# Altium project US29080671(A).PrjPCB (part 9 of 10)
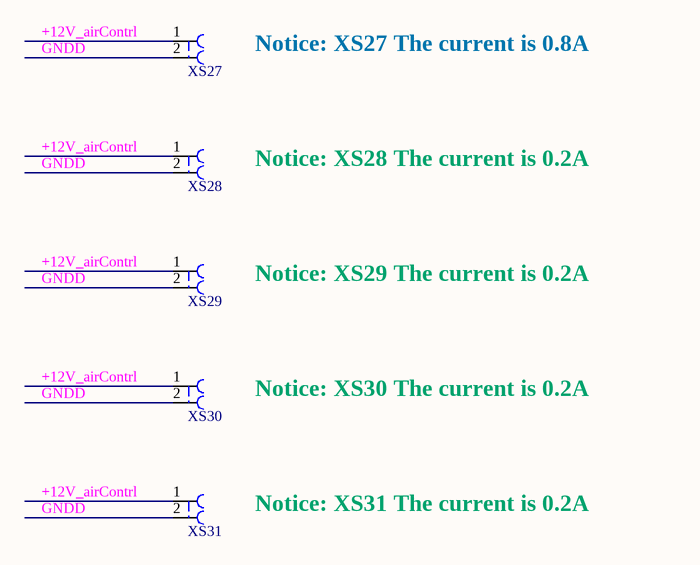
[diagram p43: MY_beamControl_R_风扇供电接口.SchDoc]
## Nets that join several sheets
GNDD: A7_JTAG&CONFIG (5 pins), A7_MGT (52 pins), A7_POWER (112 pins), A7_GND (256 pins), A7_FUNCTION2 (V18.2 V19.2), A7_FUNCTION2 - Ⅱ (V24.2 V25.2), A7_JTAG&CONFIG - Ⅱ (5 pins), A7_MGT - Ⅱ (52 pins), A7_POWER - Ⅱ (112 pins), A7_GND - Ⅱ (256 pins), POWER_B1 (17 pins), POWER_B2 (30 pins), POWER_B3 (11 pins), MY_beamControl_R_组件电源分配 (36 pins), Z7_BLOCK (7 pins), Z7_POWER1 (70 pins), Z7_POWER2 (201 pins), Z7_JTAG&DEBUG (15 pins), Z7_USB (16 pins), Z7_BANK_DDR3 (6 pins), Z7_DDR3 (85 pins), Z7_BANK500_501 (9 pins), Z7_ETHERNET (38 pins), Z7_STORAGE (32 pins), Z7_MGTX (32 pins), Z7_FUNCTION1 (8 pins), Z7_FUNCTION2 (6 pins), Z7_FUNCTION3 (8 pins), ZYNQ_reset (D26.3), MY_beamControl_R_对内接口 (108 pins), MY_beamControl_R_对外接口 (27 pins), MY_beamControl_R电平转换 (54 pins), MY_beamControl_R_风扇供电接口 (5 pins)
VCC1V0: A7_MGT (25 pins), A7_POWER (95 pins), A7_MGT - Ⅱ (25 pins), A7_POWER - Ⅱ (95 pins), POWER_B1 (22 pins), Z7_POWER1 (71 pins)
VCC1V2: A7_MGT (33 pins), A7_MGT - Ⅱ (33 pins), POWER_B2 (5 pins), Z7_POWER1 (31 pins), Z7_MGTX (D1.AB10 R241.1)
VCC1V8: A7_JTAG&CONFIG (L3.1), A7_POWER (38 pins), A7_JTAG&CONFIG - Ⅱ (L1.1), A7_POWER - Ⅱ (38 pins), POWER_B2 (5 pins), POWER_B3 (R105.2), Z7_POWER1 (46 pins), Z7_POWER2 (34 pins), Z7_JTAG&DEBUG (6 pins), Z7_USB (9 pins), Z7_BANK500_501 (10 pins), Z7_ETHERNET (D23.3 R287.2 R288.2 R289.2), Z7_STORAGE (18 pins), Z7_FUNCTION1 (5 pins), ZYNQ_reset (D26.5), MY_beamControl_R电平转换 (18 pins)
VCC1V35: POWER_B2 (5 pins), Z7_POWER1 (14 pins), Z7_BANK_DDR3 (R166.1 R171.2), Z7_DDR3 (66 pins)
VCC3V3: A7_JTAG&CONFIG (7 pins), A7_POWER (139 pins), A7_JTAG&CONFIG - Ⅱ (7 pins), A7_POWER - Ⅱ (139 pins), POWER_B3 (6 pins), Z7_BLOCK (JTAG1.2), Z7_POWER1 (C414.1 D1.P15), Z7_POWER2 (60 pins), Z7_JTAG&DEBUG (9 pins), Z7_USB (C468.1 D20.20 D20.21 R283.2), Z7_ETHERNET (12 pins), Z7_STORAGE (14 pins), Z7_FUNCTION2 (6 pins), Z7_FUNCTION3 (C342.2 D13.1), MY_beamControl_R_对外接口 (C504.1 C506.1 D24.4 L31.1)
+5V_1: MY_beamControl_R_组件电源分配 (L17.2 R120.2 XJ1.1), MY_beamControl_R_对内接口 (8 pins)
+5V_2: MY_beamControl_R_组件电源分配 (L21.2 R123.2 XJ4.1), MY_beamControl_R_对内接口 (8 pins)
+5V_3: MY_beamControl_R_组件电源分配 (L24.2 R126.2 XJ7.1), MY_beamControl_R_对内接口 (8 pins)
+5V_4: MY_beamControl_R_组件电源分配 (L26.2 R298.2 XJ9.1), MY_beamControl_R_对内接口 (8 pins)
+5V_5: MY_beamControl_R_组件电源分配 (L28.2 R300.2 XJ11.1), MY_beamControl_R_对内接口 (8 pins)
+5V_6: MY_beamControl_R_组件电源分配 (L18.2 R121.2 XJ2.1), MY_beamControl_R_对内接口 (8 pins)
+5V_7: MY_beamControl_R_组件电源分配 (L22.2 R124.2 XJ5.1), MY_beamControl_R_对内接口 (8 pins)
+5V_8: MY_beamControl_R_组件电源分配 (L25.2 R127.2 XJ8.1), MY_beamControl_R_对内接口 (8 pins)
+5V_9: MY_beamControl_R_组件电源分配 (L27.2 R299.2 XJ10.1), MY_beamControl_R_对内接口 (8 pins)
+5V_10: MY_beamControl_R_组件电源分配 (L29.2 R301.2 XJ12.1), MY_beamControl_R_对内接口 (8 pins)
+5V_11: MY_beamControl_R_组件电源分配 (L20.2 R122.2 XJ3.1), MY_beamControl_R_对内接口 (8 pins)
+5V_12: MY_beamControl_R_组件电源分配 (L23.2 R125.2 XJ6.1), MY_beamControl_R_对内接口 (8 pins)
-5V: MY_beamControl_R_对内接口 (96 pins), MY_beamControl_R_对外接口 (XS25.18 XS25.19 XS25.37)
CLK _A_1: Z7_FUNCTION3 (D1.N26), MY_beamControl_R_对内接口 (XS1.42)
CLK _A_2: Z7_FUNCTION2 (D1.AG20), MY_beamControl_R_对内接口 (XS3.42)
CLK _A_3: A7_FUNCTION2 (D2.K27), MY_beamControl_R_对内接口 (XS5.42)
CLK _A_4: A7_FUNCTION1 (D2.AL28), MY_beamControl_R_对内接口 (XS7.42)
CLK _A_5: A7_FUNCTION2 (D2.AN9), MY_beamControl_R_对内接口 (XS9.42)
CLK _A_6: A7_FUNCTION2 (D2.AE2), MY_beamControl_R_对内接口 (XS11.42)
CLK _A_7: A7_FUNCTION3 (D2.N1), MY_beamControl_R_对内接口 (XS13.42)
CLK _A_8: A7_FUNCTION2 - Ⅱ (D3.K27), MY_beamControl_R_对内接口 (XS15.42)
CLK _A_9: A7_FUNCTION1 -Ⅱ (D3.AL28), MY_beamControl_R_对内接口 (XS17.42)
CLK _A_10: A7_FUNCTION2 - Ⅱ (D3.AP4), MY_beamControl_R_对内接口 (XS19.42)
CLK _A_11: A7_FUNCTION3 - Ⅱ (D3.T2), MY_beamControl_R_对内接口 (XS21.42)
CLK _A_12: A7_FUNCTION3 - Ⅱ (D3.W6), MY_beamControl_R_对内接口 (XS23.42)
CLK_B_1: Z7_FUNCTION3 (D1.T30), MY_beamControl_R_对内接口 (XS1.11)
CLK_B_2: Z7_FUNCTION2 (D1.AJ16), MY_beamControl_R_对内接口 (XS3.11)
CLK_B_3: A7_FUNCTION2 (D2.H24), MY_beamControl_R_对内接口 (XS5.11)
CLK_B_4: A7_FUNCTION1 (D2.AE33), MY_beamControl_R_对内接口 (XS7.11)
CLK_B_5: A7_FUNCTION1 (D2.AH27), MY_beamControl_R_对内接口 (XS9.11)
CLK_B_6: A7_FUNCTION2 (D2.AD4), MY_beamControl_R_对内接口 (XS11.11)
CLK_B_7: A7_FUNCTION3 (D2.H3), MY_beamControl_R_对内接口 (XS13.11)
CLK_B_8: A7_FUNCTION2 - Ⅱ (D3.H24), MY_beamControl_R_对内接口 (XS15.11)
CLK_B_9: A7_FUNCTION1 -Ⅱ (D3.AH33), MY_beamControl_R_对内接口 (XS17.11)
CLK_B_10: A7_FUNCTION2 - Ⅱ (D3.AL9), MY_beamControl_R_对内接口 (XS19.11)
CLK_B_11: A7_FUNCTION3 - Ⅱ (D3.H3), MY_beamControl_R_对内接口 (XS21.11)
CLK_B_12: A7_FUNCTION3 - Ⅱ (D3.W3), MY_beamControl_R_对内接口 (XS23.11)
CLK_C_1: Z7_FUNCTION3 (D1.Y25), MY_beamControl_R_对内接口 (XS2.47)
CLK_C_2: Z7_FUNCTION2 (D1.AE22), MY_beamControl_R_对内接口 (XS4.47)
CLK_C_3: A7_FUNCTION2 (D2.K30), MY_beamControl_R_对内接口 (XS6.47)
CLK_C_4: A7_FUNCTION1 (D2.AF29), MY_beamControl_R_对内接口 (XS8.47)
CLK_C_5: A7_FUNCTION2 (D2.AL10), MY_beamControl_R_对内接口 (XS10.47)
CLK_C_6: A7_FUNCTION2 (D2.AG11), MY_beamControl_R_对内接口 (XS12.47)
CLK_C_7: A7_FUNCTION3 (D2.K7), MY_beamControl_R_对内接口 (XS14.47)
CLK_C_8: A7_FUNCTION2 - Ⅱ (D3.K30), MY_beamControl_R_对内接口 (XS16.47)
CLK_C_9: A7_FUNCTION1 -Ⅱ (D3.AE31), MY_beamControl_R_对内接口 (XS18.47)
CLK_C_10: A7_FUNCTION1 -Ⅱ (D3.AM25), MY_beamControl_R_对内接口 (XS20.47)
CLK_C_11: A7_FUNCTION3 - Ⅱ (D3.R10), MY_beamControl_R_对内接口 (XS22.47)
CLK_C_12: A7_FUNCTION2 - Ⅱ (D3.AL2), MY_beamControl_R_对内接口 (XS24.47)
CLK_D_1: Z7_FUNCTION3 (D1.AK27), MY_beamControl_R_对内接口 (XS2.3)
CLK_D_2: Z7_FUNCTION2 (D1.AJ21), MY_beamControl_R_对内接口 (XS4.3)
CLK_D_3: A7_FUNCTION2 (D2.J33), MY_beamControl_R_对内接口 (XS6.3)
CLK_D_4: A7_FUNCTION1 (D2.AP33), MY_beamControl_R_对内接口 (XS8.3)
CLK_D_5: A7_FUNCTION2 (D2.AP1), MY_beamControl_R_对内接口 (XS10.3)
CLK_D_6: A7_FUNCTION2 (D2.AE1), MY_beamControl_R_对内接口 (XS12.3)
CLK_D_7: A7_FUNCTION3 (D2.K6), MY_beamControl_R_对内接口 (XS14.3)
CLK_D_8: A7_FUNCTION2 - Ⅱ (D3.J33), MY_beamControl_R_对内接口 (XS16.3)
CLK_D_9: A7_FUNCTION1 -Ⅱ (D3.AD33), MY_beamControl_R_对内接口 (XS18.3)
CLK_D_10: A7_FUNCTION1 -Ⅱ (D3.AP28), MY_beamControl_R_对内接口 (XS20.3)
CLK_D_11: A7_FUNCTION3 - Ⅱ (D3.K6), MY_beamControl_R_对内接口 (XS22.3)
CLK_D_12: A7_FUNCTION2 - Ⅱ (D3.AG11), MY_beamControl_R_对内接口 (XS24.3)
CLK_ZYNQ2FPGA0: A7_JTAG&CONFIG (D2.AA30), Z7_FUNCTION3 (D1.U22)
CLK_ZYNQ2FPGA1: A7_JTAG&CONFIG - Ⅱ (D3.AA30), Z7_FUNCTION3 (D1.U24)
D1_A_1: Z7_FUNCTION3 (D1.W25), MY_beamControl_R_对内接口 (XS1.27)
D1_A_2: Z7_FUNCTION2 (D1.AG14), MY_beamControl_R_对内接口 (XS3.27)
D1_A_3: A7_FUNCTION2 (D2.L29), MY_beamControl_R_对内接口 (XS5.27)
D1_A_4: A7_FUNCTION1 (D2.AE26), MY_beamControl_R_对内接口 (XS7.27)
D1_A_5: A7_FUNCTION2 (D2.AN6), MY_beamControl_R_对内接口 (XS9.27)
D1_A_6: A7_FUNCTION3 (D2.AA2), MY_beamControl_R_对内接口 (XS11.27)
D1_A_7: A7_FUNCTION3 (D2.T3), MY_beamControl_R_对内接口 (XS13.27)
D1_A_8: A7_FUNCTION2 - Ⅱ (D3.L29), MY_beamControl_R_对内接口 (XS15.27)
D1_A_9: A7_FUNCTION1 -Ⅱ (D3.AN32), MY_beamControl_R_对内接口 (XS17.27)
D1_A_10: A7_FUNCTION2 - Ⅱ (D3.AN1), MY_beamControl_R_对内接口 (XS19.27)
D1_A_11: A7_FUNCTION3 - Ⅱ (D3.T3), MY_beamControl_R_对内接口 (XS21.27)
D1_A_12: A7_FUNCTION3 - Ⅱ (D3.W9), MY_beamControl_R_对内接口 (XS23.27)
D1_B_1: Z7_FUNCTION3 (D1.W30), MY_beamControl_R_对内接口 (XS1.21)
D1_B_2: Z7_FUNCTION2 (D1.AK13), MY_beamControl_R_对内接口 (XS3.21)
D1_B_3: A7_FUNCTION2 (D2.G26), MY_beamControl_R_对内接口 (XS5.21)
D1_B_4: A7_FUNCTION1 (D2.T34), MY_beamControl_R_对内接口 (XS7.21)
D1_B_5: A7_FUNCTION1 (D2.AM26), MY_beamControl_R_对内接口 (XS9.21)
D1_B_6: A7_FUNCTION3 (D2.Y1), MY_beamControl_R_对内接口 (XS11.21)
D1_B_7: A7_FUNCTION3 (D2.N7), MY_beamControl_R_对内接口 (XS13.21)
D1_B_8: A7_FUNCTION2 - Ⅱ (D3.G26), MY_beamControl_R_对内接口 (XS15.21)
D1_B_9: A7_FUNCTION1 -Ⅱ (D3.AL33), MY_beamControl_R_对内接口 (XS17.21)
D1_B_10: A7_FUNCTION2 - Ⅱ (D3.AG7), MY_beamControl_R_对内接口 (XS19.21)
D1_B_11: A7_FUNCTION3 - Ⅱ (D3.N7), MY_beamControl_R_对内接口 (XS21.21)
D1_B_12: A7_FUNCTION3 - Ⅱ (D3.AC1), MY_beamControl_R_对内接口 (XS23.21)
D1_C_1: Z7_FUNCTION3 (D1.R26), MY_beamControl_R_对内接口 (XS2.37)
D1_C_2: Z7_FUNCTION2 (D1.AE23), MY_beamControl_R_对内接口 (XS4.37)
D1_C_3: A7_FUNCTION2 (D2.G31), MY_beamControl_R_对内接口 (XS6.37)
D1_C_4: A7_FUNCTION1 (D2.AD31), MY_beamControl_R_对内接口 (XS8.37)
D1_C_5: A7_FUNCTION1 (D2.AE23), MY_beamControl_R_对内接口 (XS10.37)
D1_C_6: A7_FUNCTION2 (D2.AF12), MY_beamControl_R_对内接口 (XS12.37)
D1_C_7: A7_FUNCTION3 (D2.N4), MY_beamControl_R_对内接口 (XS14.37)
D1_C_8: A7_FUNCTION2 - Ⅱ (D3.G31), MY_beamControl_R_对内接口 (XS16.37)
D1_C_9: A7_FUNCTION1 -Ⅱ (D3.AD26), MY_beamControl_R_对内接口 (XS18.37)
D1_C_10: A7_FUNCTION1 -Ⅱ (D3.AL27), MY_beamControl_R_对内接口 (XS20.37)
D1_C_11: A7_FUNCTION3 - Ⅱ (D3.H11), MY_beamControl_R_对内接口 (XS22.37)
D1_C_12: A7_FUNCTION2 - Ⅱ (D3.AG1), MY_beamControl_R_对内接口 (XS24.37)
D1_D_1: Z7_FUNCTION3 (D1.AJ30), MY_beamControl_R_对内接口 (XS2.18)
D1_D_2: Z7_FUNCTION2 (D1.AK23), MY_beamControl_R_对内接口 (XS4.18)
D1_D_3: A7_FUNCTION1 (D2.U27), MY_beamControl_R_对内接口 (XS6.18)
D1_D_4: A7_FUNCTION1 (D2.AM34), MY_beamControl_R_对内接口 (XS8.18)
D1_D_5: A7_FUNCTION1 (D2.AD23), MY_beamControl_R_对内接口 (XS10.18)
D1_D_6: A7_FUNCTION2 (D2.AJ1), MY_beamControl_R_对内接口 (XS12.18)
D1_D_7: A7_FUNCTION3 (D2.J8), MY_beamControl_R_对内接口 (XS14.18)
D1_D_8: A7_FUNCTION1 -Ⅱ (D3.U27), MY_beamControl_R_对内接口 (XS16.18)
D1_D_9: A7_FUNCTION1 -Ⅱ (D3.U34), MY_beamControl_R_对内接口 (XS18.18)
D1_D_10: A7_FUNCTION1 -Ⅱ (D3.AD23), MY_beamControl_R_对内接口 (XS20.18)
D1_D_11: A7_FUNCTION3 - Ⅱ (D3.J8), MY_beamControl_R_对内接口 (XS22.18)
D1_D_12: A7_FUNCTION2 - Ⅱ (D3.AL7), MY_beamControl_R_对内接口 (XS24.18)
D2_A_1: Z7_FUNCTION3 (D1.AA27), MY_beamControl_R_对内接口 (XS1.14)
D2_A_2: Z7_FUNCTION2 (D1.AE13), MY_beamControl_R_对内接口 (XS3.14)
D2_A_3: A7_FUNCTION2 (D2.G30), MY_beamControl_R_对内接口 (XS5.14)
D2_A_4: A7_FUNCTION1 (D2.N33), MY_beamControl_R_对内接口 (XS7.14)
D2_A_5: A7_FUNCTION1 (D2.AG24), MY_beamControl_R_对内接口 (XS9.14)
D2_A_6: A7_FUNCTION3 (D2.AA4), MY_beamControl_R_对内接口 (XS11.14)
D2_A_7: A7_FUNCTION3 (D2.T4), MY_beamControl_R_对内接口 (XS13.14)
D2_A_8: A7_FUNCTION2 - Ⅱ (D3.G30), MY_beamControl_R_对内接口 (XS15.14)
D2_A_9: A7_FUNCTION1 -Ⅱ (D3.AP33), MY_beamControl_R_对内接口 (XS17.14)
D2_A_10: A7_FUNCTION2 - Ⅱ (D3.AN3), MY_beamControl_R_对内接口 (XS19.14)
D2_A_11: A7_FUNCTION3 - Ⅱ (D3.T4), MY_beamControl_R_对内接口 (XS21.14)
D2_A_12: A7_FUNCTION2 - Ⅱ (D3.AF4), MY_beamControl_R_对内接口 (XS23.14)
D2_B_1: Z7_FUNCTION3 (D1.U26), MY_beamControl_R_对内接口 (XS1.45)
D2_B_2: Z7_FUNCTION2 (D1.AG12), MY_beamControl_R_对内接口 (XS3.45)
D2_B_3: A7_FUNCTION2 (D2.M24), MY_beamControl_R_对内接口 (XS5.45)
D2_B_4: A7_FUNCTION1 (D2.U31), MY_beamControl_R_对内接口 (XS7.45)
D2_B_5: A7_FUNCTION2 (D2.AM11), MY_beamControl_R_对内接口 (XS9.45)
D2_B_6: A7_FUNCTION2 (D2.AG4), MY_beamControl_R_对内接口 (XS11.45)
D2_B_7: A7_FUNCTION3 (D2.K1), MY_beamControl_R_对内接口 (XS13.45)
D2_B_8: A7_FUNCTION2 - Ⅱ (D3.M24), MY_beamControl_R_对内接口 (XS15.45)
D2_B_9: A7_FUNCTION1 -Ⅱ (D3.U31), MY_beamControl_R_对内接口 (XS17.45)
D2_B_10: A7_FUNCTION2 - Ⅱ (D3.AP8), MY_beamControl_R_对内接口 (XS19.45)
D2_B_11: A7_FUNCTION3 - Ⅱ (D3.K1), MY_beamControl_R_对内接口 (XS21.45)
D2_B_12: A7_FUNCTION3 - Ⅱ (D3.Y3), MY_beamControl_R_对内接口 (XS23.45)
D2_C_1: Z7_FUNCTION3 (D1.P26), MY_beamControl_R_对内接口 (XS2.25)
D2_C_2: Z7_FUNCTION2 (D1.AF24), MY_beamControl_R_对内接口 (XS4.25)
D2_C_3: A7_FUNCTION2 (D2.L27), MY_beamControl_R_对内接口 (XS6.25)
D2_C_4: A7_FUNCTION1 (D2.AH34), MY_beamControl_R_对内接口 (XS8.25)
D2_C_5: A7_FUNCTION1 (D2.AF27), MY_beamControl_R_对内接口 (XS10.25)
D2_C_6: A7_FUNCTION3 (D2.Y8), MY_beamControl_R_对内接口 (XS12.25)
D2_C_7: A7_FUNCTION3 (D2.H12), MY_beamControl_R_对内接口 (XS14.25)
D2_C_8: A7_FUNCTION2 - Ⅱ (D3.L27), MY_beamControl_R_对内接口 (XS16.25)
D2_C_9: A7_FUNCTION1 -Ⅱ (D3.N34), MY_beamControl_R_对内接口 (XS18.25)
D2_C_10: A7_FUNCTION1 -Ⅱ (D3.AF27), MY_beamControl_R_对内接口 (XS20.25)
D2_C_11: A7_FUNCTION3 - Ⅱ (D3.H12), MY_beamControl_R_对内接口 (XS22.25)
D2_C_12: A7_FUNCTION2 - Ⅱ (D3.AH1), MY_beamControl_R_对内接口 (XS24.25)
D2_D_1: Z7_FUNCTION3 (D1.AD28), MY_beamControl_R_对内接口 (XS2.44)
D2_D_2: Z7_FUNCTION2 (D1.AB21), MY_beamControl_R_对内接口 (XS4.44)
D2_D_3: A7_FUNCTION2 (D2.L25), MY_beamControl_R_对内接口 (XS6.44)
D2_D_4: A7_FUNCTION1 (D2.AH32), MY_beamControl_R_对内接口 (XS8.44)
D2_D_5: A7_FUNCTION2 (D2.AL8), MY_beamControl_R_对内接口 (XS10.44)
D2_D_6: A7_FUNCTION2 (D2.AH8), MY_beamControl_R_对内接口 (XS12.44)
D2_D_7: A7_FUNCTION3 (D2.P9), MY_beamControl_R_对内接口 (XS14.44)
D2_D_8: A7_FUNCTION2 - Ⅱ (D3.L25), MY_beamControl_R_对内接口 (XS16.44)
D2_D_9: A7_FUNCTION1 -Ⅱ (D3.AF30), MY_beamControl_R_对内接口 (XS18.44)
D2_D_10: A7_FUNCTION1 -Ⅱ (D3.AL24), MY_beamControl_R_对内接口 (XS20.44)
D2_D_11: A7_FUNCTION3 - Ⅱ (D3.L8), MY_beamControl_R_对内接口 (XS22.44)
D2_D_12: A7_FUNCTION2 - Ⅱ (D3.AJ4), MY_beamControl_R_对内接口 (XS24.44)
D3_A_1: Z7_FUNCTION3 (D1.AB29), MY_beamControl_R_对内接口 (XS1.16)
D3_A_2: Z7_FUNCTION2 (D1.AF18), MY_beamControl_R_对内接口 (XS3.16)
D3_A_3: A7_FUNCTION2 (D2.H28), MY_beamControl_R_对内接口 (XS5.16)
D3_A_4: A7_FUNCTION1 (D2.N34), MY_beamControl_R_对内接口 (XS7.16)
D3_A_5: A7_FUNCTION1 (D2.AL24), MY_beamControl_R_对内接口 (XS9.16)
D3_A_6: A7_FUNCTION3 (D2.W4), MY_beamControl_R_对内接口 (XS11.16)
D3_A_7: A7_FUNCTION3 (D2.R5), MY_beamControl_R_对内接口 (XS13.16)
D3_A_8: A7_FUNCTION2 - Ⅱ (D3.H28), MY_beamControl_R_对内接口 (XS15.16)
D3_A_9: A7_FUNCTION1 -Ⅱ (D3.AP34), MY_beamControl_R_对内接口 (XS17.16)
D3_A_10: A7_FUNCTION2 - Ⅱ (D3.AJ6), MY_beamControl_R_对内接口 (XS19.16)
D3_A_11: A7_FUNCTION3 - Ⅱ (D3.R5), MY_beamControl_R_对内接口 (XS21.16)
D3_A_12: A7_FUNCTION2 - Ⅱ (D3.AF5), MY_beamControl_R_对内接口 (XS23.16)
D3_B_1: Z7_FUNCTION3 (D1.R27), MY_beamControl_R_对内接口 (XS1.47)
D3_B_2: Z7_FUNCTION2 (D1.AF14), MY_beamControl_R_对内接口 (XS3.47)
D3_B_3: A7_FUNCTION1 (D2.P26), MY_beamControl_R_对内接口 (XS5.47)
D3_B_4: A7_FUNCTION1 (D2.T32), MY_beamControl_R_对内接口 (XS7.47)
D3_B_5: A7_FUNCTION1 (D2.AN26), MY_beamControl_R_对内接口 (XS9.47)
D3_B_6: A7_FUNCTION2 (D2.AJ3), MY_beamControl_R_对内接口 (XS11.47)
D3_B_7: A7_FUNCTION3 (D2.H1), MY_beamControl_R_对内接口 (XS13.47)
D3_B_8: A7_FUNCTION1 -Ⅱ (D3.P26), MY_beamControl_R_对内接口 (XS15.47)
D3_B_9: A7_FUNCTION1 -Ⅱ (D3.T32), MY_beamControl_R_对内接口 (XS17.47)
D3_B_10: A7_FUNCTION2 - Ⅱ (D3.AM10), MY_beamControl_R_对内接口 (XS19.47)
D3_B_11: A7_FUNCTION3 - Ⅱ (D3.H1), MY_beamControl_R_对内接口 (XS21.47)
D3_B_12: A7_FUNCTION3 - Ⅱ (D3.AA3), MY_beamControl_R_对内接口 (XS23.47)
D3_C_1: Z7_FUNCTION3 (D1.AE30), MY_beamControl_R_对内接口 (XS2.23)
D3_C_2: Z7_FUNCTION2 (D1.AG24), MY_beamControl_R_对内接口 (XS4.23)
D3_C_3: A7_FUNCTION1 (D2.N29), MY_beamControl_R_对内接口 (XS6.23)
D3_C_4: A7_FUNCTION1 (D2.AJ33), MY_beamControl_R_对内接口 (XS8.23)
D3_C_5: A7_FUNCTION1 (D2.AJ25), MY_beamControl_R_对内接口 (XS10.23)
D3_C_6: A7_FUNCTION3 (D2.AA8), MY_beamControl_R_对内接口 (XS12.23)
D3_C_7: A7_FUNCTION3 (D2.M11), MY_beamControl_R_对内接口 (XS14.23)
D3_C_8: A7_FUNCTION1 -Ⅱ (D3.N29), MY_beamControl_R_对内接口 (XS16.23)
D3_C_9: A7_FUNCTION1 -Ⅱ (D3.P34), MY_beamControl_R_对内接口 (XS18.23)
D3_C_10: A7_FUNCTION1 -Ⅱ (D3.AJ25), MY_beamControl_R_对内接口 (XS20.23)
D3_C_11: A7_FUNCTION3 - Ⅱ (D3.M11), MY_beamControl_R_对内接口 (XS22.23)
D3_C_12: A7_FUNCTION2 - Ⅱ (D3.AG6), MY_beamControl_R_对内接口 (XS24.23)
D3_D_1: Z7_FUNCTION3 (D1.AD26), MY_beamControl_R_对内接口 (XS2.42)
D3_D_2: Z7_FUNCTION2 (D1.AF17), MY_beamControl_R_对内接口 (XS4.42)
D3_D_3: A7_FUNCTION1 (D2.P29), MY_beamControl_R_对内接口 (XS6.42)
D3_D_4: A7_FUNCTION1 (D2.AK32), MY_beamControl_R_对内接口 (XS8.42)
D3_D_5: A7_FUNCTION2 (D2.AM6), MY_beamControl_R_对内接口 (XS10.42)
D3_D_6: A7_FUNCTION2 (D2.AE6), MY_beamControl_R_对内接口 (XS12.42)
D3_D_7: A7_FUNCTION3 (D2.R11), MY_beamControl_R_对内接口 (XS14.42)
D3_D_8: A7_FUNCTION1 -Ⅱ (D3.P29), MY_beamControl_R_对内接口 (XS16.42)
D3_D_9: A7_FUNCTION1 -Ⅱ (D3.AH31), MY_beamControl_R_对内接口 (XS18.42)
D3_D_10: A7_FUNCTION1 -Ⅱ (D3.AG24), MY_beamControl_R_对内接口 (XS20.42)
D3_D_11: A7_FUNCTION3 - Ⅱ (D3.P4), MY_beamControl_R_对内接口 (XS22.42)
D3_D_12: A7_FUNCTION2 - Ⅱ (D3.AH4), MY_beamControl_R_对内接口 (XS24.42)
D4_A_1: Z7_FUNCTION3 (D1.W28), MY_beamControl_R_对内接口 (XS1.40)
D4_A_2: Z7_FUNCTION2 (D1.AG16), MY_beamControl_R_对内接口 (XS3.40)
D4_A_3: A7_FUNCTION2 (D2.K31), MY_beamControl_R_对内接口 (XS5.40)
D4_A_4: A7_FUNCTION1 (D2.AC26), MY_beamControl_R_对内接口 (XS7.40)
D4_A_5: A7_FUNCTION2 (D2.AP6), MY_beamControl_R_对内接口 (XS9.40)
D4_A_6: A7_FUNCTION3 (D2.AB2), MY_beamControl_R_对内接口 (XS11.40)
D4_A_7: A7_FUNCTION3 (D2.T2), MY_beamControl_R_对内接口 (XS13.40)
D4_A_8: A7_FUNCTION2 - Ⅱ (D3.K31), MY_beamControl_R_对内接口 (XS15.40)
D4_A_9: A7_FUNCTION1 -Ⅱ (D3.AM31), MY_beamControl_R_对内接口 (XS17.40)
D4_A_10: A7_FUNCTION2 - Ⅱ (D3.AP1), MY_beamControl_R_对内接口 (XS19.40)
D4_A_11: A7_FUNCTION3 - Ⅱ (D3.R1), MY_beamControl_R_对内接口 (XS21.40)
D4_A_12: A7_FUNCTION3 - Ⅱ (D3.V8), MY_beamControl_R_对内接口 (XS23.40)
D4_B_1: Z7_FUNCTION3 (D1.V29), MY_beamControl_R_对内接口 (XS1.9)
D4_B_2: Z7_FUNCTION2 (D1.AJ14), MY_beamControl_R_对内接口 (XS3.9)
D4_B_3: A7_FUNCTION2 (D2.J25), MY_beamControl_R_对内接口 (XS5.9)
D4_B_4: A7_FUNCTION1 (D2.T33), MY_beamControl_R_对内接口 (XS7.9)
D4_B_5: A7_FUNCTION1 (D2.AK27), MY_beamControl_R_对内接口 (XS9.9)
D4_B_6: A7_FUNCTION3 (D2.Y3), MY_beamControl_R_对内接口 (XS11.9)
D4_B_7: A7_FUNCTION3 (D2.M7), MY_beamControl_R_对内接口 (XS13.9)
D4_B_8: A7_FUNCTION2 - Ⅱ (D3.J25), MY_beamControl_R_对内接口 (XS15.9)
D4_B_9: A7_FUNCTION1 -Ⅱ (D3.AF34), MY_beamControl_R_对内接口 (XS17.9)
D4_B_10: A7_FUNCTION2 - Ⅱ (D3.AL8), MY_beamControl_R_对内接口 (XS19.9)
D4_B_11: A7_FUNCTION3 - Ⅱ (D3.M7), MY_beamControl_R_对内接口 (XS21.9)
D4_B_12: A7_FUNCTION3 - Ⅱ (D3.AB2), MY_beamControl_R_对内接口 (XS23.9)
D4_C_1: Z7_FUNCTION3 (D1.N29), MY_beamControl_R_对内接口 (XS2.49)
D4_C_2: Z7_FUNCTION2 (D1.AD23), MY_beamControl_R_对内接口 (XS4.49)
D4_C_3: A7_FUNCTION2 (D2.G32), MY_beamControl_R_对内接口 (XS6.49)
D4_C_4: A7_FUNCTION1 (D2.AE31), MY_beamControl_R_对内接口 (XS8.49)
D4_C_5: A7_FUNCTION2 (D2.AJ10), MY_beamControl_R_对内接口 (XS10.49)
D4_C_6: A7_FUNCTION2 (D2.AG12), MY_beamControl_R_对内接口 (XS12.49)
D4_C_7: A7_FUNCTION3 (D2.P4), MY_beamControl_R_对内接口 (XS14.49)
D4_C_8: A7_FUNCTION2 - Ⅱ (D3.G32), MY_beamControl_R_对内接口 (XS16.49)
D4_C_9: A7_FUNCTION1 -Ⅱ (D3.AD30), MY_beamControl_R_对内接口 (XS18.49)
D4_C_10: A7_FUNCTION1 -Ⅱ (D3.AM26), MY_beamControl_R_对内接口 (XS20.49)
D4_C_11: A7_FUNCTION3 - Ⅱ (D3.J11), MY_beamControl_R_对内接口 (XS22.49)
D4_C_12: A7_FUNCTION2 - Ⅱ (D3.AE1), MY_beamControl_R_对内接口 (XS24.49)
D4_D_1: Z7_FUNCTION3 (D1.AJ29), MY_beamControl_R_对内接口 (XS2.5)
D4_D_2: Z7_FUNCTION2 (D1.AJ23), MY_beamControl_R_对内接口 (XS4.5)
D4_D_3: A7_FUNCTION1 (D2.U26), MY_beamControl_R_对内接口 (XS6.5)
D4_D_4: A7_FUNCTION1 (D2.AN34), MY_beamControl_R_对内接口 (XS8.5)
D4_D_5: A7_FUNCTION2 (D2.AP4), MY_beamControl_R_对内接口 (XS10.5)
D4_D_6: A7_FUNCTION3 (D2.V9), MY_beamControl_R_对内接口 (XS12.5)
D4_D_7: A7_FUNCTION3 (D2.H8), MY_beamControl_R_对内接口 (XS14.5)
D4_D_8: A7_FUNCTION1 -Ⅱ (D3.U26), MY_beamControl_R_对内接口 (XS16.5)
D4_D_9: A7_FUNCTION1 -Ⅱ (D3.T33), MY_beamControl_R_对内接口 (XS18.5)
D4_D_10: A7_FUNCTION1 -Ⅱ (D3.AP30), MY_beamControl_R_对内接口 (XS20.5)
D4_D_11: A7_FUNCTION3 - Ⅱ (D3.H8), MY_beamControl_R_对内接口 (XS22.5)
D4_D_12: A7_FUNCTION2 - Ⅱ (D3.AH8), MY_beamControl_R_对内接口 (XS24.5)
D5_A_1: Z7_FUNCTION3 (D1.AC29), MY_beamControl_R_对内接口 (XS1.3)
D5_A_2: Z7_FUNCTION2 (D1.AG17), MY_beamControl_R_对内接口 (XS3.3)
D5_A_3: A7_FUNCTION2 (D2.G29), MY_beamControl_R_对内接口 (XS5.3)
D5_A_4: A7_FUNCTION1 (D2.P33), MY_beamControl_R_对内接口 (XS7.3)
D5_A_5: A7_FUNCTION1 (D2.AK25), MY_beamControl_R_对内接口 (XS9.3)
D5_A_6: A7_FUNCTION3 (D2.V4), MY_beamControl_R_对内接口 (XS11.3)
D5_A_7: A7_FUNCTION3 (D2.T5), MY_beamControl_R_对内接口 (XS13.3)
D5_A_8: A7_FUNCTION2 - Ⅱ (D3.G29), MY_beamControl_R_对内接口 (XS15.3)
D5_A_9: A7_FUNCTION1 -Ⅱ (D3.AN33), MY_beamControl_R_对内接口 (XS17.3)
D5_A_10: A7_FUNCTION2 - Ⅱ (D3.AL4), MY_beamControl_R_对内接口 (XS19.3)
D5_A_11: A7_FUNCTION3 - Ⅱ (D3.T5), MY_beamControl_R_对内接口 (XS21.3)
D5_A_12: A7_FUNCTION2 - Ⅱ (D3.AF2), MY_beamControl_R_对内接口 (XS23.3)
D5_B_1: Z7_FUNCTION3 (D1.U27), MY_beamControl_R_对内接口 (XS1.34)
D5_B_2: Z7_FUNCTION2 (D1.AF13), MY_beamControl_R_对内接口 (XS3.34)
D5_B_3: A7_FUNCTION1 (D2.P25), MY_beamControl_R_对内接口 (XS5.34)
D5_B_4: A7_FUNCTION1 (D2.T30), MY_beamControl_R_对内接口 (XS7.34)
D5_B_5: A7_FUNCTION1 (D2.AP26), MY_beamControl_R_对内接口 (XS9.34)
D5_B_6: A7_FUNCTION2 (D2.AH3), MY_beamControl_R_对内接口 (XS11.34)
D5_B_7: A7_FUNCTION3 (D2.J1), MY_beamControl_R_对内接口 (XS13.34)
D5_B_8: A7_FUNCTION1 -Ⅱ (D3.P25), MY_beamControl_R_对内接口 (XS15.34)
D5_B_9: A7_FUNCTION1 -Ⅱ (D3.T30), MY_beamControl_R_对内接口 (XS17.34)
D5_B_10: A7_FUNCTION2 - Ⅱ (D3.AP9), MY_beamControl_R_对内接口 (XS19.34)
D5_B_11: A7_FUNCTION3 - Ⅱ (D3.J1), MY_beamControl_R_对内接口 (XS21.34)
D5_B_12: A7_FUNCTION3 - Ⅱ (D3.AA2), MY_beamControl_R_对内接口 (XS23.34)
D5_C_1: Z7_FUNCTION3 (D1.AD29), MY_beamControl_R_对内接口 (XS2.11)
D5_C_2: Z7_FUNCTION2 (D1.AJ25), MY_beamControl_R_对内接口 (XS4.11)
D5_C_3: A7_FUNCTION1 (D2.N28), MY_beamControl_R_对内接口 (XS6.11)
D5_C_4: A7_FUNCTION1 (D2.AJ34), MY_beamControl_R_对内接口 (XS8.11)
D5_C_5: A7_FUNCTION1 (D2.AJ26), MY_beamControl_R_对内接口 (XS10.11)
D5_C_6: A7_FUNCTION3 (D2.Y10), MY_beamControl_R_对内接口 (XS12.11)
D5_C_7: A7_FUNCTION3 (D2.L12), MY_beamControl_R_对内接口 (XS14.11)
D5_C_8: A7_FUNCTION1 -Ⅱ (D3.N28), MY_beamControl_R_对内接口 (XS16.11)
D5_C_9: A7_FUNCTION1 -Ⅱ (D3.N33), MY_beamControl_R_对内接口 (XS18.11)
D5_C_10: A7_FUNCTION1 -Ⅱ (D3.AJ26), MY_beamControl_R_对内接口 (XS20.11)
D5_C_11: A7_FUNCTION3 - Ⅱ (D3.L12), MY_beamControl_R_对内接口 (XS22.11)
D5_C_12: A7_FUNCTION2 - Ⅱ (D3.AH2), MY_beamControl_R_对内接口 (XS24.11)
D5_D_1: Z7_FUNCTION3 (D1.AC26), MY_beamControl_R_对内接口 (XS2.30)
D5_D_2: Z7_FUNCTION2 (D1.AH19), MY_beamControl_R_对内接口 (XS4.30)
D5_D_3: A7_FUNCTION2 (D2.M26), MY_beamControl_R_对内接口 (XS6.30)
D5_D_4: A7_FUNCTION1 (D2.AJ30), MY_beamControl_R_对内接口 (XS8.30)
D5_D_5: A7_FUNCTION2 (D2.AL7), MY_beamControl_R_对内接口 (XS10.30)
D5_D_6: A7_FUNCTION2 (D2.AG6), MY_beamControl_R_对内接口 (XS12.30)
D5_D_7: A7_FUNCTION3 (D2.P10), MY_beamControl_R_对内接口 (XS14.30)
D5_D_8: A7_FUNCTION2 - Ⅱ (D3.M26), MY_beamControl_R_对内接口 (XS16.30)
D5_D_9: A7_FUNCTION1 -Ⅱ (D3.AG32), MY_beamControl_R_对内接口 (XS18.30)
D5_D_10: A7_FUNCTION1 -Ⅱ (D3.AH24), MY_beamControl_R_对内接口 (XS20.30)
D5_D_11: A7_FUNCTION3 - Ⅱ (D3.J6), MY_beamControl_R_对内接口 (XS22.30)
D5_D_12: A7_FUNCTION2 - Ⅱ (D3.AK7), MY_beamControl_R_对内接口 (XS24.30)
D6_A_1: Z7_FUNCTION3 (D1.V27), MY_beamControl_R_对内接口 (XS1.41)
D6_A_2: Z7_FUNCTION2 (D1.AG19), MY_beamControl_R_对内接口 (XS3.41)
D6_A_3: A7_FUNCTION2 (D2.J29), MY_beamControl_R_对内接口 (XS5.41)
D6_A_4: A7_FUNCTION1 (D2.AM30), MY_beamControl_R_对内接口 (XS7.41)
D6_A_5: A7_FUNCTION2 (D2.AN8), MY_beamControl_R_对内接口 (XS9.41)
D6_A_6: A7_FUNCTION3 (D2.AC3), MY_beamControl_R_对内接口 (XS11.41)
D6_A_7: A7_FUNCTION3 (D2.R1), MY_beamControl_R_对内接口 (XS13.41)
D6_A_8: A7_FUNCTION2 - Ⅱ (D3.J29), MY_beamControl_R_对内接口 (XS15.41)
D6_A_9: A7_FUNCTION1 -Ⅱ (D3.AM30), MY_beamControl_R_对内接口 (XS17.41)
D6_A_10: A7_FUNCTION2 - Ⅱ (D3.AP3), MY_beamControl_R_对内接口 (XS19.41)
D6_A_11: A7_FUNCTION3 - Ⅱ (D3.R2), MY_beamControl_R_对内接口 (XS21.41)
D6_A_12: A7_FUNCTION3 - Ⅱ (D3.V6), MY_beamControl_R_对内接口 (XS23.41)
D6_B_1: Z7_FUNCTION3 (D1.U30), MY_beamControl_R_对内接口 (XS1.10)
D6_B_2: Z7_FUNCTION2 (D1.AK15), MY_beamControl_R_对内接口 (XS3.10)
D6_B_3: A7_FUNCTION2 (D2.G24), MY_beamControl_R_对内接口 (XS5.10)
D6_B_4: A7_FUNCTION1 (D2.AD34), MY_beamControl_R_对内接口 (XS7.10)
D6_B_5: A7_FUNCTION1 (D2.AL27), MY_beamControl_R_对内接口 (XS9.10)
D6_B_6: A7_FUNCTION3 (D2.AB4), MY_beamControl_R_对内接口 (XS11.10)
D6_B_7: A7_FUNCTION3 (D2.K3), MY_beamControl_R_对内接口 (XS13.10)
D6_B_8: A7_FUNCTION2 - Ⅱ (D3.G24), MY_beamControl_R_对内接口 (XS15.10)
D6_B_9: A7_FUNCTION1 -Ⅱ (D3.AF33), MY_beamControl_R_对内接口 (XS17.10)
D6_B_10: A7_FUNCTION2 - Ⅱ (D3.AM9), MY_beamControl_R_对内接口 (XS19.10)
D6_B_11: A7_FUNCTION3 - Ⅱ (D3.K3), MY_beamControl_R_对内接口 (XS21.10)
D6_B_12: A7_FUNCTION3 - Ⅱ (D3.Y2), MY_beamControl_R_对内接口 (XS23.10)
D6_C_1: Z7_FUNCTION3 (D1.AA28), MY_beamControl_R_对内接口 (XS2.48)
D6_C_2: Z7_FUNCTION2 (D1.AF23), MY_beamControl_R_对内接口 (XS4.48)
D6_C_3: A7_FUNCTION2 (D2.H32), MY_beamControl_R_对内接口 (XS6.48)
D6_C_4: A7_FUNCTION1 (D2.AE28), MY_beamControl_R_对内接口 (XS8.48)
D6_C_5: A7_FUNCTION2 (D2.AK11), MY_beamControl_R_对内接口 (XS10.48)
D6_C_6: A7_FUNCTION2 (D2.AE10), MY_beamControl_R_对内接口 (XS12.48)
D6_C_7: A7_FUNCTION3 (D2.M5), MY_beamControl_R_对内接口 (XS14.48)
D6_C_8: A7_FUNCTION2 - Ⅱ (D3.H32), MY_beamControl_R_对内接口 (XS16.48)
D6_C_9: A7_FUNCTION1 -Ⅱ (D3.AD31), MY_beamControl_R_对内接口 (XS18.48)
D6_C_10: A7_FUNCTION1 -Ⅱ (D3.AK26), MY_beamControl_R_对内接口 (XS20.48)
D6_C_11: A7_FUNCTION3 - Ⅱ (D3.R11), MY_beamControl_R_对内接口 (XS22.48)
D6_C_12: A7_FUNCTION2 - Ⅱ (D3.AL3), MY_beamControl_R_对内接口 (XS24.48)
D6_D_1: Z7_FUNCTION3 (D1.AJ28), MY_beamControl_R_对内接口 (XS2.4)
D6_D_2: Z7_FUNCTION2 (D1.AK22), MY_beamControl_R_对内接口 (XS4.4)
D6_D_3: A7_FUNCTION2 (D2.G34), MY_beamControl_R_对内接口 (XS6.4)
D6_D_4: A7_FUNCTION1 (D2.AP34), MY_beamControl_R_对内接口 (XS8.4)
D6_D_5: A7_FUNCTION2 (D2.AP3), MY_beamControl_R_对内接口 (XS10.4)
D6_D_6: A7_FUNCTION3 (D2.V8), MY_beamControl_R_对内接口 (XS12.4)
D6_D_7: A7_FUNCTION3 (D2.G7), MY_beamControl_R_对内接口 (XS14.4)
D6_D_8: A7_FUNCTION2 - Ⅱ (D3.G34), MY_beamControl_R_对内接口 (XS16.4)
D6_D_9: A7_FUNCTION1 -Ⅱ (D3.AD34), MY_beamControl_R_对内接口 (XS18.4)
D6_D_10: A7_FUNCTION1 -Ⅱ (D3.AP29), MY_beamControl_R_对内接口 (XS20.4)
D6_D_11: A7_FUNCTION3 - Ⅱ (D3.G7), MY_beamControl_R_对内接口 (XS22.4)
D6_D_12: A7_FUNCTION2 - Ⅱ (D3.AG10), MY_beamControl_R_对内接口 (XS24.4)
D7_A_1: Z7_FUNCTION3 (D1.AD30), MY_beamControl_R_对内接口 (XS1.2)
D7_A_2: Z7_FUNCTION2 (D1.AF15), MY_beamControl_R_对内接口 (XS3.2)
D7_A_3: A7_FUNCTION2 (D2.H29), MY_beamControl_R_对内接口 (XS5.2)
D7_A_4: A7_FUNCTION1 (D2.AE30), MY_beamControl_R_对内接口 (XS7.2)
D7_A_5: A7_FUNCTION1 (D2.AH24), MY_beamControl_R_对内接口 (XS9.2)
D7_A_6: A7_FUNCTION3 (D2.W5), MY_beamControl_R_对内接口 (XS11.2)
D7_A_7: A7_FUNCTION3 (D2.U5), MY_beamControl_R_对内接口 (XS13.2)
D7_A_8: A7_FUNCTION2 - Ⅱ (D3.H29), MY_beamControl_R_对内接口 (XS15.2)
D7_A_9: A7_FUNCTION1 -Ⅱ (D3.AN31), MY_beamControl_R_对内接口 (XS17.2)
D7_A_10: A7_FUNCTION2 - Ⅱ (D3.AM4), MY_beamControl_R_对内接口 (XS19.2)
D7_A_11: A7_FUNCTION3 - Ⅱ (D3.U5), MY_beamControl_R_对内接口 (XS21.2)
D7_A_12: A7_FUNCTION2 - Ⅱ (D3.AF3), MY_beamControl_R_对内接口 (XS23.2)
D7_B_1: Z7_FUNCTION3 (D1.T27), MY_beamControl_R_对内接口 (XS1.33)
D7_B_2: Z7_FUNCTION2 (D1.AH12), MY_beamControl_R_对内接口 (XS3.33)
D7_B_3: A7_FUNCTION1 (D2.N24), MY_beamControl_R_对内接口 (XS5.33)
D7_B_4: A7_FUNCTION1 (D2.U32), MY_beamControl_R_对内接口 (XS7.33)
D7_B_5: A7_FUNCTION1 (D2.AP25), MY_beamControl_R_对内接口 (XS9.33)
D7_B_6: A7_FUNCTION2 (D2.AH2), MY_beamControl_R_对内接口 (XS11.33)
D7_B_7: A7_FUNCTION3 (D2.K2), MY_beamControl_R_对内接口 (XS13.33)
D7_B_8: A7_FUNCTION1 -Ⅱ (D3.N24), MY_beamControl_R_对内接口 (XS15.33)
D7_B_9: A7_FUNCTION1 -Ⅱ (D3.U32), MY_beamControl_R_对内接口 (XS17.33)
D7_B_10: A7_FUNCTION2 - Ⅱ (D3.AN9), MY_beamControl_R_对内接口 (XS19.33)
D7_B_11: A7_FUNCTION3 - Ⅱ (D3.K2), MY_beamControl_R_对内接口 (XS21.33)
D7_B_12: A7_FUNCTION3 - Ⅱ (D3.AA5), MY_beamControl_R_对内接口 (XS23.33)
D7_C_1: Z7_FUNCTION3 (D1.U25), MY_beamControl_R_对内接口 (XS2.12)
D7_C_2: Z7_FUNCTION2 (D1.AG25), MY_beamControl_R_对内接口 (XS4.12)
D7_C_3: A7_FUNCTION1 (D2.N27), MY_beamControl_R_对内接口 (XS6.12)
D7_C_4: A7_FUNCTION1 (D2.AH33), MY_beamControl_R_对内接口 (XS8.12)
D7_C_5: A7_FUNCTION1 (D2.AE27), MY_beamControl_R_对内接口 (XS10.12)
D7_C_6: A7_FUNCTION3 (D2.Y11), MY_beamControl_R_对内接口 (XS12.12)
D7_C_7: A7_FUNCTION3 (D2.K12), MY_beamControl_R_对内接口 (XS14.12)
D7_C_8: A7_FUNCTION1 -Ⅱ (D3.N27), MY_beamControl_R_对内接口 (XS16.12)
D7_C_9: A7_FUNCTION1 -Ⅱ (D3.M34), MY_beamControl_R_对内接口 (XS18.12)
D7_C_10: A7_FUNCTION1 -Ⅱ (D3.AE27), MY_beamControl_R_对内接口 (XS20.12)
D7_C_11: A7_FUNCTION3 - Ⅱ (D3.K12), MY_beamControl_R_对内接口 (XS22.12)
D7_C_12: A7_FUNCTION2 - Ⅱ (D3.AJ1), MY_beamControl_R_对内接口 (XS24.12)
D7_D_1: Z7_FUNCTION3 (D1.AB25), MY_beamControl_R_对内接口 (XS2.31)
D7_D_2: Z7_FUNCTION2 (D1.AE18), MY_beamControl_R_对内接口 (XS4.31)
D7_D_3: A7_FUNCTION2 (D2.M25), MY_beamControl_R_对内接口 (XS6.31)
D7_D_4: A7_FUNCTION1 (D2.AJ31), MY_beamControl_R_对内接口 (XS8.31)
D7_D_5: A7_FUNCTION2 (D2.AM7), MY_beamControl_R_对内接口 (XS10.31)
D7_D_6: A7_FUNCTION2 (D2.AF8), MY_beamControl_R_对内接口 (XS12.31)
D7_D_7: A7_FUNCTION3 (D2.R10), MY_beamControl_R_对内接口 (XS14.31)
D7_D_8: A7_FUNCTION2 - Ⅱ (D3.M25), MY_beamControl_R_对内接口 (XS16.31)
D7_D_9: A7_FUNCTION1 -Ⅱ (D3.AF32), MY_beamControl_R_对内接口 (XS18.31)
D7_D_10: A7_FUNCTION1 -Ⅱ (D3.AK25), MY_beamControl_R_对内接口 (XS20.31)
D7_D_11: A7_FUNCTION3 - Ⅱ (D3.K7), MY_beamControl_R_对内接口 (XS22.31)
D7_D_12: A7_FUNCTION2 - Ⅱ (D3.AJ3), MY_beamControl_R_对内接口 (XS24.31)
D8_A_1: Z7_FUNCTION3 (D1.Y28), MY_beamControl_R_对内接口 (XS1.26)
D8_A_2: Z7_FUNCTION2 (D1.AA13), MY_beamControl_R_对内接口 (XS3.26)
D8_A_3: A7_FUNCTION2 (D2.L28), MY_beamControl_R_对内接口 (XS5.26)
D8_A_4: A7_FUNCTION1 (D2.AD26), MY_beamControl_R_对内接口 (XS7.26)
D8_A_5: A7_FUNCTION2 (D2.AP5), MY_beamControl_R_对内接口 (XS9.26)
D8_A_6: A7_FUNCTION3 (D2.Y2), MY_beamControl_R_对内接口 (XS11.26)
D8_A_7: A7_FUNCTION3 (D2.U4), MY_beamControl_R_对内接口 (XS13.26)
D8_A_8: A7_FUNCTION2 - Ⅱ (D3.L28), MY_beamControl_R_对内接口 (XS15.26)
D8_A_9: A7_FUNCTION1 -Ⅱ (D3.AP31), MY_beamControl_R_对内接口 (XS17.26)
D8_A_10: A7_FUNCTION2 - Ⅱ (D3.AM1), MY_beamControl_R_对内接口 (XS19.26)
D8_A_11: A7_FUNCTION3 - Ⅱ (D3.U4), MY_beamControl_R_对内接口 (XS21.26)
D8_A_12: A7_FUNCTION3 - Ⅱ (D3.V9), MY_beamControl_R_对内接口 (XS23.26)
D8_B_1: Z7_FUNCTION3 (D1.W29), MY_beamControl_R_对内接口 (XS1.20)
D8_B_2: Z7_FUNCTION2 (D1.AF12), MY_beamControl_R_对内接口 (XS3.20)
D8_B_3: A7_FUNCTION2 (D2.L24), MY_beamControl_R_对内接口 (XS5.20)
D8_B_4: A7_FUNCTION1 (D2.R33), MY_beamControl_R_对内接口 (XS7.20)
D8_B_5: A7_FUNCTION2 (D2.AP11), MY_beamControl_R_对内接口 (XS9.20)
D8_B_6: A7_FUNCTION3 (D2.W3), MY_beamControl_R_对内接口 (XS11.20)
D8_B_7: A7_FUNCTION3 (D2.N3), MY_beamControl_R_对内接口 (XS13.20)
D8_B_8: A7_FUNCTION2 - Ⅱ (D3.L24), MY_beamControl_R_对内接口 (XS15.20)
D8_B_9: A7_FUNCTION1 -Ⅱ (D3.AJ33), MY_beamControl_R_对内接口 (XS17.20)
D8_B_10: A7_FUNCTION2 - Ⅱ (D3.AN8), MY_beamControl_R_对内接口 (XS19.20)
D8_B_11: A7_FUNCTION3 - Ⅱ (D3.N3), MY_beamControl_R_对内接口 (XS21.20)
D8_B_12: A7_FUNCTION3 - Ⅱ (D3.AC2), MY_beamControl_R_对内接口 (XS23.20)
D8_C_1: Z7_FUNCTION3 (D1.T28), MY_beamControl_R_对内接口 (XS2.38)
D8_C_2: Z7_FUNCTION2 (D1.AD24), MY_beamControl_R_对内接口 (XS4.38)
D8_C_3: A7_FUNCTION2 (D2.J30), MY_beamControl_R_对内接口 (XS6.38)
D8_C_4: A7_FUNCTION1 (D2.AD30), MY_beamControl_R_对内接口 (XS8.38)
D8_C_5: A7_FUNCTION1 (D2.AF23), MY_beamControl_R_对内接口 (XS10.38)
D8_C_6: A7_FUNCTION2 (D2.AD11), MY_beamControl_R_对内接口 (XS12.38)
D8_C_7: A7_FUNCTION3 (D2.M4), MY_beamControl_R_对内接口 (XS14.38)
D8_C_8: A7_FUNCTION2 - Ⅱ (D3.J30), MY_beamControl_R_对内接口 (XS16.38)
D8_C_9: A7_FUNCTION1 -Ⅱ (D3.AE26), MY_beamControl_R_对内接口 (XS18.38)
D8_C_10: A7_FUNCTION1 -Ⅱ (D3.AM27), MY_beamControl_R_对内接口 (XS20.38)
D8_C_11: A7_FUNCTION3 - Ⅱ (D3.G11), MY_beamControl_R_对内接口 (XS22.38)
D8_C_12: A7_FUNCTION2 - Ⅱ (D3.AE2), MY_beamControl_R_对内接口 (XS24.38)
D8_D_1: Z7_FUNCTION3 (D1.AH29), MY_beamControl_R_对内接口 (XS2.19)
D8_D_2: Z7_FUNCTION2 (D1.AD21), MY_beamControl_R_对内接口 (XS4.19)
D8_D_3: A7_FUNCTION1 (D2.U29), MY_beamControl_R_对内接口 (XS6.19)
D8_D_4: A7_FUNCTION1 (D2.AH31), MY_beamControl_R_对内接口 (XS8.19)
D8_D_5: A7_FUNCTION1 (D2.AC24), MY_beamControl_R_对内接口 (XS10.19)
D8_D_6: A7_FUNCTION2 (D2.AK1), MY_beamControl_R_对内接口 (XS12.19)
D8_D_7: A7_FUNCTION3 (D2.K8), MY_beamControl_R_对内接口 (XS14.19)
D8_D_8: A7_FUNCTION1 -Ⅱ (D3.U29), MY_beamControl_R_对内接口 (XS16.19)
D8_D_9: A7_FUNCTION1 -Ⅱ (D3.AF29), MY_beamControl_R_对内接口 (XS18.19)
D8_D_10: A7_FUNCTION1 -Ⅱ (D3.AC24), MY_beamControl_R_对内接口 (XS20.19)
D8_D_11: A7_FUNCTION3 - Ⅱ (D3.K8), MY_beamControl_R_对内接口 (XS22.19)
D8_D_12: A7_FUNCTION2 - Ⅱ (D3.AM7), MY_beamControl_R_对内接口 (XS24.19)
D9_A_1: Z7_FUNCTION3 (D1.AB30), MY_beamControl_R_对内接口 (XS1.17)
D9_A_2: Z7_FUNCTION2 (D1.AH21), MY_beamControl_R_对内接口 (XS3.17)
D9_A_3: A7_FUNCTION2 (D2.H27), MY_beamControl_R_对内接口 (XS5.17)
D9_A_4: A7_FUNCTION1 (D2.M34), MY_beamControl_R_对内接口 (XS7.17)
D9_A_5: A7_FUNCTION1 (D2.AL25), MY_beamControl_R_对内接口 (XS9.17)
D9_A_6: A7_FUNCTION3 (D2.V3), MY_beamControl_R_对内接口 (XS11.17)
D9_A_7: A7_FUNCTION3 (D2.N2), MY_beamControl_R_对内接口 (XS13.17)
D9_A_8: A7_FUNCTION2 - Ⅱ (D3.H27), MY_beamControl_R_对内接口 (XS15.17)
D9_A_9: A7_FUNCTION1 -Ⅱ (D3.AN34), MY_beamControl_R_对内接口 (XS17.17)
D9_A_10: A7_FUNCTION2 - Ⅱ (D3.AK6), MY_beamControl_R_对内接口 (XS19.17)
D9_A_11: A7_FUNCTION3 - Ⅱ (D3.N2), MY_beamControl_R_对内接口 (XS21.17)
D9_A_12: A7_FUNCTION2 - Ⅱ (D3.AD3), MY_beamControl_R_对内接口 (XS23.17)
D9_B_1: Z7_FUNCTION3 (D1.P28), MY_beamControl_R_对内接口 (XS1.48)
D9_B_2: Z7_FUNCTION2 (D1.AE15), MY_beamControl_R_对内接口 (XS3.48)
D9_B_3: A7_FUNCTION1 (D2.R26), MY_beamControl_R_对内接口 (XS5.48)
D9_B_4: A7_FUNCTION1 (D2.R31), MY_beamControl_R_对内接口 (XS7.48)
D9_B_5: A7_FUNCTION1 (D2.AP28), MY_beamControl_R_对内接口 (XS9.48)
D9_B_6: A7_FUNCTION2 (D2.AK2), MY_beamControl_R_对内接口 (XS11.48)
D9_B_7: A7_FUNCTION3 (D2.H2), MY_beamControl_R_对内接口 (XS13.48)
D9_B_8: A7_FUNCTION1 -Ⅱ (D3.R26), MY_beamControl_R_对内接口 (XS15.48)
D9_B_9: A7_FUNCTION1 -Ⅱ (D3.R31), MY_beamControl_R_对内接口 (XS17.48)
D9_B_10: A7_FUNCTION2 - Ⅱ (D3.AN11), MY_beamControl_R_对内接口 (XS19.48)
D9_B_11: A7_FUNCTION3 - Ⅱ (D3.H2), MY_beamControl_R_对内接口 (XS21.48)
D9_B_12: A7_FUNCTION3 - Ⅱ (D3.AA4), MY_beamControl_R_对内接口 (XS23.48)
D9_C_1: Z7_FUNCTION3 (D1.AF30), MY_beamControl_R_对内接口 (XS2.22)
D9_C_2: Z7_FUNCTION2 (D1.AK25), MY_beamControl_R_对内接口 (XS4.22)
D9_C_3: A7_FUNCTION1 (D2.P28), MY_beamControl_R_对内接口 (XS6.22)
D9_C_4: A7_FUNCTION1 (D2.AK33), MY_beamControl_R_对内接口 (XS8.22)
D9_C_5: A7_FUNCTION1 (D2.AF24), MY_beamControl_R_对内接口 (XS10.22)
D9_C_6: A7_FUNCTION3 (D2.AB11), MY_beamControl_R_对内接口 (XS12.22)
D9_C_7: A7_FUNCTION3 (D2.M10), MY_beamControl_R_对内接口 (XS14.22)
D9_C_8: A7_FUNCTION1 -Ⅱ (D3.P28), MY_beamControl_R_对内接口 (XS16.22)
D9_C_9: A7_FUNCTION1 -Ⅱ (D3.P33), MY_beamControl_R_对内接口 (XS18.22)
D9_C_10: A7_FUNCTION1 -Ⅱ (D3.AF24), MY_beamControl_R_对内接口 (XS20.22)
D9_C_11: A7_FUNCTION3 - Ⅱ (D3.M10), MY_beamControl_R_对内接口 (XS22.22)
D9_C_12: A7_FUNCTION2 - Ⅱ (D3.AE6), MY_beamControl_R_对内接口 (XS24.22)
D9_D_1: Z7_FUNCTION3 (D1.AD25), MY_beamControl_R_对内接口 (XS2.41)
D9_D_2: Z7_FUNCTION2 (D1.AK20), MY_beamControl_R_对内接口 (XS4.41)
D9_D_3: A7_FUNCTION1 (D2.P30), MY_beamControl_R_对内接口 (XS6.41)
D9_D_4: A7_FUNCTION1 (D2.AL32), MY_beamControl_R_对内接口 (XS8.41)
D9_D_5: A7_FUNCTION2 (D2.AL5), MY_beamControl_R_对内接口 (XS10.41)
D9_D_6: A7_FUNCTION2 (D2.AD6), MY_beamControl_R_对内接口 (XS12.41)
D9_D_7: A7_FUNCTION3 (D2.K11), MY_beamControl_R_对内接口 (XS14.41)
D9_D_8: A7_FUNCTION1 -Ⅱ (D3.P30), MY_beamControl_R_对内接口 (XS16.41)
D9_D_9: A7_FUNCTION1 -Ⅱ (D3.AJ30), MY_beamControl_R_对内接口 (XS18.41)
D9_D_10: A7_FUNCTION1 -Ⅱ (D3.AE23), MY_beamControl_R_对内接口 (XS20.41)
D9_D_11: A7_FUNCTION3 - Ⅱ (D3.N4), MY_beamControl_R_对内接口 (XS22.41)
D9_D_12: A7_FUNCTION2 - Ⅱ (D3.AH3), MY_beamControl_R_对内接口 (XS24.41)
D10_A_1: Z7_FUNCTION3 (D1.T24), MY_beamControl_R_对内接口 (XS1.30)
D10_A_2: Z7_FUNCTION2 (D1.AD13), MY_beamControl_R_对内接口 (XS3.30)
D10_A_3: A7_FUNCTION2 (D2.K26), MY_beamControl_R_对内接口 (XS5.30)
D10_A_4: A7_FUNCTION1 (D2.AK28), MY_beamControl_R_对内接口 (XS7.30)
D10_A_5: A7_FUNCTION2 (D2.AP9), MY_beamControl_R_对内接口 (XS9.30)
D10_A_6: A7_FUNCTION2 (D2.AE3), MY_beamControl_R_对内接口 (XS11.30)
D10_A_7: A7_FUNCTION3 (D2.M1), MY_beamControl_R_对内接口 (XS13.30)
D10_A_8: A7_FUNCTION2 - Ⅱ (D3.K26), MY_beamControl_R_对内接口 (XS15.30)
D10_A_9: A7_FUNCTION1 -Ⅱ (D3.AK28), MY_beamControl_R_对内接口 (XS17.30)
D10_A_10: A7_FUNCTION2 - Ⅱ (D3.AP5), MY_beamControl_R_对内接口 (XS19.30)
D10_A_11: A7_FUNCTION3 - Ⅱ (D3.M1), MY_beamControl_R_对内接口 (XS21.30)
D10_A_12: A7_FUNCTION3 - Ⅱ (D3.Y7), MY_beamControl_R_对内接口 (XS23.30)
D10_B_1: Z7_FUNCTION3 (D1.R30), MY_beamControl_R_对内接口 (XS1.24)
D10_B_2: Z7_FUNCTION2 (D1.AH16), MY_beamControl_R_对内接口 (XS3.24)
D10_B_3: A7_FUNCTION2 (D2.K23), MY_beamControl_R_对内接口 (XS5.24)
D10_B_4: A7_FUNCTION1 (D2.AF34), MY_beamControl_R_对内接口 (XS7.24)
D10_B_5: A7_FUNCTION1 (D2.AM29), MY_beamControl_R_对内接口 (XS9.24)
D10_B_6: A7_FUNCTION2 (D2.AF3), MY_beamControl_R_对内接口 (XS11.24)
D10_B_7: A7_FUNCTION3 (D2.F3), MY_beamControl_R_对内接口 (XS13.24)
D10_B_8: A7_FUNCTION2 - Ⅱ (D3.K23), MY_beamControl_R_对内接口 (XS15.24)
D10_B_9: A7_FUNCTION1 -Ⅱ (D3.AJ34), MY_beamControl_R_对内接口 (XS17.24)
D10_B_10: A7_FUNCTION2 - Ⅱ (D3.AL10), MY_beamControl_R_对内接口 (XS19.24)
D10_B_11: A7_FUNCTION3 - Ⅱ (D3.F3), MY_beamControl_R_对内接口 (XS21.24)
D10_B_12: A7_FUNCTION3 - Ⅱ (D3.V1), MY_beamControl_R_对内接口 (XS23.24)
D10_C_1: Z7_FUNCTION3 (D1.AB27), MY_beamControl_R_对内接口 (XS2.34)
D10_C_2: Z7_FUNCTION2 (D1.AH22), MY_beamControl_R_对内接口 (XS4.34)
D10_C_3: A7_FUNCTION2 (D2.K32), MY_beamControl_R_对内接口 (XS6.34)
D10_C_4: A7_FUNCTION1 (D2.AF30), MY_beamControl_R_对内接口 (XS8.34)
D10_C_5: A7_FUNCTION2 (D2.AL9), MY_beamControl_R_对内接口 (XS10.34)
D10_C_6: A7_FUNCTION2 (D2.AH11), MY_beamControl_R_对内接口 (XS12.34)
D10_C_7: A7_FUNCTION3 (D2.L8), MY_beamControl_R_对内接口 (XS14.34)
D10_C_8: A7_FUNCTION2 - Ⅱ (D3.K32), MY_beamControl_R_对内接口 (XS16.34)
D10_C_9: A7_FUNCTION1 -Ⅱ (D3.AE30), MY_beamControl_R_对内接口 (XS18.34)
D10_C_10: A7_FUNCTION1 -Ⅱ (D3.AG27), MY_beamControl_R_对内接口 (XS20.34)
D10_C_11: A7_FUNCTION3 - Ⅱ (D3.P9), MY_beamControl_R_对内接口 (XS22.34)
D10_C_12: A7_FUNCTION2 - Ⅱ (D3.AM6), MY_beamControl_R_对内接口 (XS24.34)
D10_D_1: Z7_FUNCTION3 (D1.AH28), MY_beamControl_R_对内接口 (XS2.15)
D10_D_2: Z7_FUNCTION2 (D1.AJ19), MY_beamControl_R_对内接口 (XS4.15)
D10_D_3: A7_FUNCTION2 (D2.K33), MY_beamControl_R_对内接口 (XS6.15)
D10_D_4: A7_FUNCTION1 (D2.AN32), MY_beamControl_R_对内接口 (XS8.15)
D10_D_5: A7_FUNCTION2 (D2.AM4), MY_beamControl_R_对内接口 (XS10.15)
D10_D_6: A7_FUNCTION2 (D2.AD1), MY_beamControl_R_对内接口 (XS12.15)
D10_D_7: A7_FUNCTION3 (D2.J4), MY_beamControl_R_对内接口 (XS14.15)
D10_D_8: A7_FUNCTION2 - Ⅱ (D3.J34), MY_beamControl_R_对内接口 (XS16.15)
D10_D_9: A7_FUNCTION1 -Ⅱ (D3.AK32), MY_beamControl_R_对内接口 (XS18.15)
D10_D_10: A7_FUNCTION1 -Ⅱ (D3.AF23), MY_beamControl_R_对内接口 (XS20.15)
D10_D_11: A7_FUNCTION3 - Ⅱ (D3.L5), MY_beamControl_R_对内接口 (XS22.15)
D10_D_12: A7_FUNCTION2 - Ⅱ (D3.AD11), MY_beamControl_R_对内接口 (XS24.15)
D11_A_1: Z7_FUNCTION3 (D1.AA29), MY_beamControl_R_对内接口 (XS1.5)
D11_A_2: Z7_FUNCTION2 (D1.AK12), MY_beamControl_R_对内接口 (XS3.5)
D11_A_3: A7_FUNCTION2 (D2.G27), MY_beamControl_R_对内接口 (XS5.5)
D11_A_4: A7_FUNCTION1 (D2.P34), MY_beamControl_R_对内接口 (XS7.5)
D11_A_5: A7_FUNCTION1 (D2.AM25), MY_beamControl_R_对内接口 (XS9.5)
D11_A_6: A7_FUNCTION3 (D2.V1), MY_beamControl_R_对内接口 (XS11.5)
D11_A_7: A7_FUNCTION3 (D2.R3), MY_beamControl_R_对内接口 (XS13.5)
D11_A_8: A7_FUNCTION2 - Ⅱ (D3.G27), MY_beamControl_R_对内接口 (XS15.5)
D11_A_9: A7_FUNCTION1 -Ⅱ (D3.AM34), MY_beamControl_R_对内接口 (XS17.5)
D11_A_10: A7_FUNCTION2 - Ⅱ (D3.AL5), MY_beamControl_R_对内接口 (XS19.5)
D11_A_11: A7_FUNCTION3 - Ⅱ (D3.R3), MY_beamControl_R_对内接口 (XS21.5)
D11_A_12: A7_FUNCTION2 - Ⅱ (D3.AE3), MY_beamControl_R_对内接口 (XS23.5)
D11_B_1: Z7_FUNCTION3 (D1.N27), MY_beamControl_R_对内接口 (XS1.36)
D11_B_2: Z7_FUNCTION2 (D1.AE16), MY_beamControl_R_对内接口 (XS3.36)
D11_B_3: A7_FUNCTION1 (D2.T24), MY_beamControl_R_对内接口 (XS5.36)
D11_B_4: A7_FUNCTION1 (D2.R32), MY_beamControl_R_对内接口 (XS7.36)
D11_B_5: A7_FUNCTION1 (D2.AN28), MY_beamControl_R_对内接口 (XS9.36)
D11_B_6: A7_FUNCTION2 (D2.AL2), MY_beamControl_R_对内接口 (XS11.36)
D11_B_7: A7_FUNCTION3 (D2.G1), MY_beamControl_R_对内接口 (XS13.36)
D11_B_8: A7_FUNCTION1 -Ⅱ (D3.T24), MY_beamControl_R_对内接口 (XS15.36)
D11_B_9: A7_FUNCTION1 -Ⅱ (D3.R32), MY_beamControl_R_对内接口 (XS17.36)
D11_B_10: A7_FUNCTION2 - Ⅱ (D3.AP11), MY_beamControl_R_对内接口 (XS19.36)
D11_B_11: A7_FUNCTION3 - Ⅱ (D3.G1), MY_beamControl_R_对内接口 (XS21.36)
D11_B_12: A7_FUNCTION3 - Ⅱ (D3.AC3), MY_beamControl_R_对内接口 (XS23.36)
D11_C_1: Z7_FUNCTION3 (D1.AF29), MY_beamControl_R_对内接口 (XS2.9)
D11_C_2: Z7_FUNCTION2 (D1.AH24), MY_beamControl_R_对内接口 (XS4.9)
D11_C_3: A7_FUNCTION1 (D2.R28), MY_beamControl_R_对内接口 (XS6.9)
D11_C_4: A7_FUNCTION1 (D2.AL34), MY_beamControl_R_对内接口 (XS8.9)
D11_C_5: A7_FUNCTION1 (D2.AF25), MY_beamControl_R_对内接口 (XS10.9)
D11_C_6: A7_FUNCTION3 (D2.W8), MY_beamControl_R_对内接口 (XS12.9)
D11_C_7: A7_FUNCTION3 (D2.G9), MY_beamControl_R_对内接口 (XS14.9)
D11_C_8: A7_FUNCTION1 -Ⅱ (D3.R28), MY_beamControl_R_对内接口 (XS16.9)
D11_C_9: A7_FUNCTION1 -Ⅱ (D3.R33), MY_beamControl_R_对内接口 (XS18.9)
D11_C_10: A7_FUNCTION1 -Ⅱ (D3.AF25), MY_beamControl_R_对内接口 (XS20.9)
D11_C_11: A7_FUNCTION3 - Ⅱ (D3.G9), MY_beamControl_R_对内接口 (XS22.9)
D11_C_12: A7_FUNCTION2 - Ⅱ (D3.AK1), MY_beamControl_R_对内接口 (XS24.9)
D11_D_1: Z7_FUNCTION3 (D1.AE26), MY_beamControl_R_对内接口 (XS2.28)
D11_D_2: Z7_FUNCTION2 (D1.AJ20), MY_beamControl_R_对内接口 (XS4.28)
D11_D_3: A7_FUNCTION2 (D2.H34), MY_beamControl_R_对内接口 (XS6.28)
D11_D_4: A7_FUNCTION1 (D2.AL30), MY_beamControl_R_对内接口 (XS8.28)
D11_D_5: A7_FUNCTION2 (D2.AJ6), MY_beamControl_R_对内接口 (XS10.28)
D11_D_6: A7_FUNCTION3 (D2.AC7), MY_beamControl_R_对内接口 (XS12.28)
D11_D_7: A7_FUNCTION3 (D2.H11), MY_beamControl_R_对内接口 (XS14.28)
D11_D_8: A7_FUNCTION2 - Ⅱ (D3.H34), MY_beamControl_R_对内接口 (XS16.28)
D11_D_9: A7_FUNCTION1 -Ⅱ (D3.AJ31), MY_beamControl_R_对内接口 (XS18.28)
D11_D_10: A7_FUNCTION2 - Ⅱ (D3.AJ10), MY_beamControl_R_对内接口 (XS20.28)
D11_D_11: A7_FUNCTION3 - Ⅱ (D3.M5), MY_beamControl_R_对内接口 (XS22.28)
D11_D_12: A7_FUNCTION2 - Ⅱ (D3.AE11), MY_beamControl_R_对内接口 (XS24.28)
D12_A_1: Z7_FUNCTION3 (D1.V28), MY_beamControl_R_对内接口 (XS1.29)
D12_A_2: Z7_FUNCTION2 (D1.AF19), MY_beamControl_R_对内接口 (XS3.29)
D12_A_3: A7_FUNCTION2 (D2.J28), MY_beamControl_R_对内接口 (XS5.29)
D12_A_4: A7_FUNCTION1 (D2.AL29), MY_beamControl_R_对内接口 (XS7.29)
D12_A_5: A7_FUNCTION2 (D2.AP8), MY_beamControl_R_对内接口 (XS9.29)
D12_A_6: A7_FUNCTION2 (D2.AD3), MY_beamControl_R_对内接口 (XS11.29)
D12_A_7: A7_FUNCTION3 (D2.P1), MY_beamControl_R_对内接口 (XS13.29)
D12_A_8: A7_FUNCTION2 - Ⅱ (D3.J28), MY_beamControl_R_对内接口 (XS15.29)
D12_A_9: A7_FUNCTION1 -Ⅱ (D3.AL29), MY_beamControl_R_对内接口 (XS17.29)
D12_A_10: A7_FUNCTION2 - Ⅱ (D3.AN4), MY_beamControl_R_对内接口 (XS19.29)
D12_A_11: A7_FUNCTION3 - Ⅱ (D3.N1), MY_beamControl_R_对内接口 (XS21.29)
D12_A_12: A7_FUNCTION3 - Ⅱ (D3.W8), MY_beamControl_R_对内接口 (XS23.29)
D12_B_1: Z7_FUNCTION3 (D1.T29), MY_beamControl_R_对内接口 (XS1.23)
D12_B_2: Z7_FUNCTION2 (D1.AH14), MY_beamControl_R_对内接口 (XS3.23)
D12_B_3: A7_FUNCTION2 (D2.G25), MY_beamControl_R_对内接口 (XS5.23)
D12_B_4: A7_FUNCTION1 (D2.AD33), MY_beamControl_R_对内接口 (XS7.23)
D12_B_5: A7_FUNCTION1 (D2.AN27), MY_beamControl_R_对内接口 (XS9.23)
D12_B_6: A7_FUNCTION3 (D2.AC4), MY_beamControl_R_对内接口 (XS11.23)
D12_B_7: A7_FUNCTION3 (D2.J3), MY_beamControl_R_对内接口 (XS13.23)
D12_B_8: A7_FUNCTION2 - Ⅱ (D3.G25), MY_beamControl_R_对内接口 (XS15.23)
D12_B_9: A7_FUNCTION1 -Ⅱ (D3.AK33), MY_beamControl_R_对内接口 (XS17.23)
D12_B_10: A7_FUNCTION2 - Ⅱ (D3.AP10), MY_beamControl_R_对内接口 (XS19.23)
D12_B_11: A7_FUNCTION3 - Ⅱ (D3.J3), MY_beamControl_R_对内接口 (XS21.23)
D12_B_12: A7_FUNCTION3 - Ⅱ (D3.Y1), MY_beamControl_R_对内接口 (XS23.23)
D12_C_1: Z7_FUNCTION3 (D1.Y27), MY_beamControl_R_对内接口 (XS2.35)
D12_C_2: Z7_FUNCTION2 (D1.AH23), MY_beamControl_R_对内接口 (XS4.35)
D12_C_3: A7_FUNCTION2 (D2.J31), MY_beamControl_R_对内接口 (XS6.35)
D12_C_4: A7_FUNCTION1 (D2.AF28), MY_beamControl_R_对内接口 (XS8.35)
D12_C_5: A7_FUNCTION2 (D2.AK10), MY_beamControl_R_对内接口 (XS10.35)
D12_C_6: A7_FUNCTION2 (D2.AF10), MY_beamControl_R_对内接口 (XS12.35)
D12_C_7: A7_FUNCTION3 (D2.J6), MY_beamControl_R_对内接口 (XS14.35)
D12_C_8: A7_FUNCTION2 - Ⅱ (D3.J31), MY_beamControl_R_对内接口 (XS16.35)
D12_C_9: A7_FUNCTION1 -Ⅱ (D3.AD28), MY_beamControl_R_对内接口 (XS18.35)
D12_C_10: A7_FUNCTION1 -Ⅱ (D3.AM29), MY_beamControl_R_对内接口 (XS20.35)
D12_C_11: A7_FUNCTION3 - Ⅱ (D3.P10), MY_beamControl_R_对内接口 (XS22.35)
D12_C_12: A7_FUNCTION2 - Ⅱ (D3.AM2), MY_beamControl_R_对内接口 (XS24.35)
D12_D_1: Z7_FUNCTION3 (D1.AK28), MY_beamControl_R_对内接口 (XS2.16)
D12_D_2: Z7_FUNCTION2 (D1.AK21), MY_beamControl_R_对内接口 (XS4.16)
D12_D_3: A7_FUNCTION2 (D2.H33), MY_beamControl_R_对内接口 (XS6.16)
D12_D_4: A7_FUNCTION1 (D2.AN33), MY_beamControl_R_对内接口 (XS8.16)
D12_D_5: A7_FUNCTION2 (D2.AN2), MY_beamControl_R_对内接口 (XS10.16)
D12_D_6: A7_FUNCTION2 (D2.AG1), MY_beamControl_R_对内接口 (XS12.16)
D12_D_7: A7_FUNCTION3 (D2.G5), MY_beamControl_R_对内接口 (XS14.16)
D12_D_8: A7_FUNCTION2 - Ⅱ (D3.H33), MY_beamControl_R_对内接口 (XS16.16)
D12_D_9: A7_FUNCTION1 -Ⅱ (D3.AE33), MY_beamControl_R_对内接口 (XS18.16)
D12_D_10: A7_FUNCTION1 -Ⅱ (D3.AN28), MY_beamControl_R_对内接口 (XS20.16)
D12_D_11: A7_FUNCTION3 - Ⅱ (D3.G5), MY_beamControl_R_对内接口 (XS22.16)
D12_D_12: A7_FUNCTION2 - Ⅱ (D3.AH11), MY_beamControl_R_对内接口 (XS24.16)
D13_A_1: Z7_FUNCTION3 (D1.AA30), MY_beamControl_R_对内接口 (XS1.6)
D13_A_2: Z7_FUNCTION2 (D1.AJ13), MY_beamControl_R_对内接口 (XS3.6)
D13_A_3: A7_FUNCTION2 (D2.H26), MY_beamControl_R_对内接口 (XS5.6)
D13_A_4: A7_FUNCTION1 (D2.AJ29), MY_beamControl_R_对内接口 (XS7.6)
D13_A_5: A7_FUNCTION1 (D2.AK26), MY_beamControl_R_对内接口 (XS9.6)
D13_A_6: A7_FUNCTION3 (D2.V2), MY_beamControl_R_对内接口 (XS11.6)
D13_A_7: A7_FUNCTION3 (D2.P6), MY_beamControl_R_对内接口 (XS13.6)
D13_A_8: A7_FUNCTION2 - Ⅱ (D3.H26), MY_beamControl_R_对内接口 (XS15.6)
D13_A_9: A7_FUNCTION1 -Ⅱ (D3.AJ29), MY_beamControl_R_对内接口 (XS17.6)
D13_A_10: A7_FUNCTION2 - Ⅱ (D3.AF7), MY_beamControl_R_对内接口 (XS19.6)
D13_A_11: A7_FUNCTION3 - Ⅱ (D3.P6), MY_beamControl_R_对内接口 (XS21.6)
D13_A_12: A7_FUNCTION2 - Ⅱ (D3.AD4), MY_beamControl_R_对内接口 (XS23.6)
D13_B_1: Z7_FUNCTION3 (D1.R28), MY_beamControl_R_对内接口 (XS1.37)
D13_B_2: Z7_FUNCTION2 (D1.AD16), MY_beamControl_R_对内接口 (XS3.37)
D13_B_3: A7_FUNCTION1 (D2.R27), MY_beamControl_R_对内接口 (XS5.37)
D13_B_4: A7_FUNCTION1 (D2.P31), MY_beamControl_R_对内接口 (XS7.37)
D13_B_5: A7_FUNCTION1 (D2.AP29), MY_beamControl_R_对内接口 (XS9.37)
D13_B_6: A7_FUNCTION2 (D2.AL3), MY_beamControl_R_对内接口 (XS11.37)
D13_B_7: A7_FUNCTION3 (D2.G2), MY_beamControl_R_对内接口 (XS13.37)
D13_B_8: A7_FUNCTION1 -Ⅱ (D3.R27), MY_beamControl_R_对内接口 (XS15.37)
D13_B_9: A7_FUNCTION1 -Ⅱ (D3.P31), MY_beamControl_R_对内接口 (XS17.37)
D13_B_10: A7_FUNCTION2 - Ⅱ (D3.AM11), MY_beamControl_R_对内接口 (XS19.37)
D13_B_11: A7_FUNCTION3 - Ⅱ (D3.G2), MY_beamControl_R_对内接口 (XS21.37)
D13_B_12: A7_FUNCTION3 - Ⅱ (D3.AC4), MY_beamControl_R_对内接口 (XS23.37)
D13_C_1: Z7_FUNCTION3 (D1.AG30), MY_beamControl_R_对内接口 (XS2.8)
D13_C_2: Z7_FUNCTION2 (D1.AJ24), MY_beamControl_R_对内接口 (XS4.8)
D13_C_3: A7_FUNCTION1 (D2.T29), MY_beamControl_R_对内接口 (XS6.8)
D13_C_4: A7_FUNCTION1 (D2.AL33), MY_beamControl_R_对内接口 (XS8.8)
D13_C_5: A7_FUNCTION1 (D2.AD25), MY_beamControl_R_对内接口 (XS10.8)
D13_C_6: A7_FUNCTION3 (D2.W9), MY_beamControl_R_对内接口 (XS12.8)
D13_C_7: A7_FUNCTION3 (D2.H9), MY_beamControl_R_对内接口 (XS14.8)
D13_C_8: A7_FUNCTION1 -Ⅱ (D3.T29), MY_beamControl_R_对内接口 (XS16.8)
D13_C_9: A7_FUNCTION1 -Ⅱ (D3.T34), MY_beamControl_R_对内接口 (XS18.8)
D13_C_10: A7_FUNCTION1 -Ⅱ (D3.AD25), MY_beamControl_R_对内接口 (XS20.8)
D13_C_11: A7_FUNCTION3 - Ⅱ (D3.H9), MY_beamControl_R_对内接口 (XS22.8)
D13_C_12: A7_FUNCTION2 - Ⅱ (D3.AK2), MY_beamControl_R_对内接口 (XS24.8)
D13_D_1: Z7_FUNCTION3 (D1.AF25), MY_beamControl_R_对内接口 (XS2.27)
D13_D_2: Z7_FUNCTION2 (D1.AK18), MY_beamControl_R_对内接口 (XS4.27)
D13_D_3: A7_FUNCTION2 (D2.J34), MY_beamControl_R_对内接口 (XS6.27)
D13_D_4: A7_FUNCTION1 (D2.AM32), MY_beamControl_R_对内接口 (XS8.27)
D13_D_5: A7_FUNCTION2 (D2.AL4), MY_beamControl_R_对内接口 (XS10.27)
D13_D_6: A7_FUNCTION2 (D2.AD5), MY_beamControl_R_对内接口 (XS12.27)
D13_D_7: A7_FUNCTION3 (D2.G11), MY_beamControl_R_对内接口 (XS14.27)
D13_D_8: A7_FUNCTION2 - Ⅱ (D3.K33), MY_beamControl_R_对内接口 (XS16.27)
D13_D_9: A7_FUNCTION1 -Ⅱ (D3.AK30), MY_beamControl_R_对内接口 (XS18.27)
D13_D_10: A7_FUNCTION2 - Ⅱ (D3.AJ11), MY_beamControl_R_对内接口 (XS20.27)
D13_D_11: A7_FUNCTION3 - Ⅱ (D3.P5), MY_beamControl_R_对内接口 (XS22.27)
D13_D_12: A7_FUNCTION2 - Ⅱ (D3.AF12), MY_beamControl_R_对内接口 (XS24.27)
D14_A_1: Z7_FUNCTION3 (D1.P25), MY_beamControl_R_对内接口 (XS1.44)
D14_A_2: Z7_FUNCTION2 (D1.AE12), MY_beamControl_R_对内接口 (XS3.44)
D14_A_3: A7_FUNCTION2 (D2.J24), MY_beamControl_R_对内接口 (XS5.44)
D14_A_4: A7_FUNCTION1 (D2.AG29), MY_beamControl_R_对内接口 (XS7.44)
D14_A_5: A7_FUNCTION2 (D2.AN11), MY_beamControl_R_对内接口 (XS9.44)
D14_A_6: A7_FUNCTION2 (D2.AG2), MY_beamControl_R_对内接口 (XS11.44)
D14_A_7: A7_FUNCTION3 (D2.L2), MY_beamControl_R_对内接口 (XS13.44)
D14_A_8: A7_FUNCTION2 - Ⅱ (D3.J24), MY_beamControl_R_对内接口 (XS15.44)
D14_A_9: A7_FUNCTION1 -Ⅱ (D3.AG29), MY_beamControl_R_对内接口 (XS17.44)
D14_A_10: A7_FUNCTION2 - Ⅱ (D3.AN7), MY_beamControl_R_对内接口 (XS19.44)
D14_A_11: A7_FUNCTION3 - Ⅱ (D3.L2), MY_beamControl_R_对内接口 (XS21.44)
D14_A_12: A7_FUNCTION3 - Ⅱ (D3.Y5), MY_beamControl_R_对内接口 (XS23.44)
D14_B_1: Z7_FUNCTION3 (D1.P30), MY_beamControl_R_对内接口 (XS1.13)
D14_B_2: Z7_FUNCTION2 (D1.AG22), MY_beamControl_R_对内接口 (XS3.13)
D14_B_3: A7_FUNCTION2 (D2.L23), MY_beamControl_R_对内接口 (XS5.13)
D14_B_4: A7_FUNCTION1 (D2.AG34), MY_beamControl_R_对内接口 (XS7.13)
D14_B_5: A7_FUNCTION1 (D2.AP30), MY_beamControl_R_对内接口 (XS9.13)
D14_B_6: A7_FUNCTION2 (D2.AH4), MY_beamControl_R_对内接口 (XS11.13)
D14_B_7: A7_FUNCTION3 (D2.H4), MY_beamControl_R_对内接口 (XS13.13)
D14_B_8: A7_FUNCTION2 - Ⅱ (D3.L23), MY_beamControl_R_对内接口 (XS15.13)
D14_B_9: A7_FUNCTION1 -Ⅱ (D3.AG34), MY_beamControl_R_对内接口 (XS17.13)
D14_B_10: A7_FUNCTION1 -Ⅱ (D3.AP26), MY_beamControl_R_对内接口 (XS19.13)
D14_B_11: A7_FUNCTION3 - Ⅱ (D3.H4), MY_beamControl_R_对内接口 (XS21.13)
D14_B_12: A7_FUNCTION3 - Ⅱ (D3.V2), MY_beamControl_R_对内接口 (XS23.13)
D14_C_1: Z7_FUNCTION3 (D1.AC27), MY_beamControl_R_对内接口 (XS2.45)
D14_C_2: Z7_FUNCTION2 (D1.AE21), MY_beamControl_R_对内接口 (XS4.45)
D14_C_3: A7_FUNCTION2 (D2.L32), MY_beamControl_R_对内接口 (XS6.45)
D14_C_4: A7_FUNCTION1 (D2.AG32), MY_beamControl_R_对内接口 (XS8.45)
D14_C_5: A7_FUNCTION2 (D2.AK8), MY_beamControl_R_对内接口 (XS10.45)
D14_C_6: A7_FUNCTION2 (D2.AJ9), MY_beamControl_R_对内接口 (XS12.45)
D14_C_7: A7_FUNCTION3 (D2.P8), MY_beamControl_R_对内接口 (XS14.45)
D14_C_8: A7_FUNCTION2 - Ⅱ (D3.L32), MY_beamControl_R_对内接口 (XS16.45)
D14_C_9: A7_FUNCTION1 -Ⅱ (D3.AF28), MY_beamControl_R_对内接口 (XS18.45)
D14_C_10: A7_FUNCTION1 -Ⅱ (D3.AL25), MY_beamControl_R_对内接口 (XS20.45)
D14_C_11: A7_FUNCTION3 - Ⅱ (D3.N8), MY_beamControl_R_对内接口 (XS22.45)
D14_C_12: A7_FUNCTION2 - Ⅱ (D3.AK3), MY_beamControl_R_对内接口 (XS24.45)
D14_D_1: Z7_FUNCTION3 (D1.AG26), MY_beamControl_R_对内接口 (XS2.1)
D14_D_2: Z7_FUNCTION2 (D1.AK16), MY_beamControl_R_对内接口 (XS4.1)
D14_D_3: A7_FUNCTION2 (D2.L34), MY_beamControl_R_对内接口 (XS6.1)
D14_D_4: A7_FUNCTION1 (D2.AP31), MY_beamControl_R_对内接口 (XS8.1)
D14_D_5: A7_FUNCTION2 (D2.AM1), MY_beamControl_R_对内接口 (XS10.1)
D14_D_6: A7_FUNCTION3 (D2.AB1), MY_beamControl_R_对内接口 (XS12.1)
D14_D_7: A7_FUNCTION3 (D2.L5), MY_beamControl_R_对内接口 (XS14.1)
D14_D_8: A7_FUNCTION2 - Ⅱ (D3.L34), MY_beamControl_R_对内接口 (XS16.1)
D14_D_9: A7_FUNCTION1 -Ⅱ (D3.AL32), MY_beamControl_R_对内接口 (XS18.1)
D14_D_10: A7_FUNCTION1 -Ⅱ (D3.AN26), MY_beamControl_R_对内接口 (XS20.1)
D14_D_11: A7_FUNCTION3 - Ⅱ (D3.J4), MY_beamControl_R_对内接口 (XS22.1)
D14_D_12: A7_FUNCTION2 - Ⅱ (D3.AD10), MY_beamControl_R_对内接口 (XS24.1)
D15_A_1: Z7_FUNCTION3 (D1.V26), MY_beamControl_R_对内接口 (XS1.43)
D15_A_2: Z7_FUNCTION2 (D1.AD14), MY_beamControl_R_对内接口 (XS3.43)